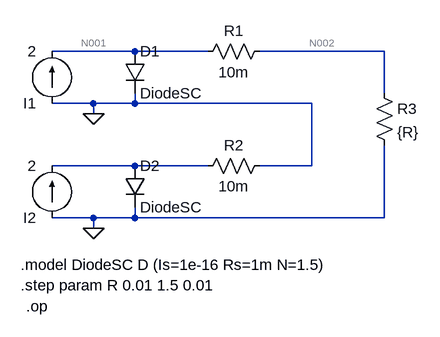
[diagram p0: schematic Draft4.asc]
Draft4.asc, the LTspice schematic file:
Version 4
SHEET 1 880 680
WIRE 128 128 0 128
WIRE 240 128 128 128
WIRE 512 128 320 128
WIRE 512 192 512 128
WIRE 64 208 0 208
WIRE 128 208 128 192
WIRE 128 208 64 208
WIRE 400 208 128 208
WIRE 64 224 64 208
WIRE 128 304 0 304
WIRE 240 304 128 304
WIRE 400 304 400 208
WIRE 400 304 320 304
WIRE 64 384 0 384
WIRE 128 384 128 368
WIRE 128 384 64 384
WIRE 512 384 512 272
WIRE 512 384 128 384
WIRE 64 400 64 384
FLAG 64 224 0
FLAG 64 400 0
SYMBOL diode 112 128 R0
SYMATTR InstName D1
SYMATTR Value DiodeSC
SYMBOL current 0 208 R180
WINDOW 123 0 0 Left 0
WINDOW 39 0 0 Left 0
SYMATTR InstName I1
SYMATTR Value 2
SYMBOL res 336 112 R90
WINDOW 0 0 56 VBottom 2
WINDOW 3 32 56 VTop 2
SYMATTR InstName R1
SYMATTR Value 10m
SYMBOL diode 112 304 R0
SYMATTR InstName D2
SYMATTR Value DiodeSC
SYMBOL current 0 384 R180
WINDOW 123 0 0 Left 0
WINDOW 39 0 0 Left 0
SYMATTR InstName I2
SYMATTR Value 2
SYMBOL res 336 288 R90
WINDOW 0 0 56 VBottom 2
WINDOW 3 32 56 VTop 2
SYMATTR InstName R2
SYMATTR Value 10m
SYMBOL res 496 176 R0
SYMATTR InstName R3
SYMATTR Value {R}
TEXT -48 456 Left 2 !.model DiodeSC D (Is=1e-16 Rs=1m N=1.5)
TEXT -48 488 Left 2 !.step param R 0.01 1.5 0.01
TEXT -40 520 Left 2 !.op

The netlist it stands for:
* Draft4.asc
D1 N001 0 DiodeSC
I1 0 N001 2
R1 N002 N001 10m
D2 N003 0 DiodeSC
I2 0 N003 2
R2 0 N003 10m
R3 N002 0 {R}
.model D D
.lib standard.dio
.model DiodeSC D (Is=1e-16 Rs=1m N=1.5)
.step param R 0.01 1.5 0.01
.op
.backanno
.end

* Results of the author's LTspice run, read from the files saved beside the schematic
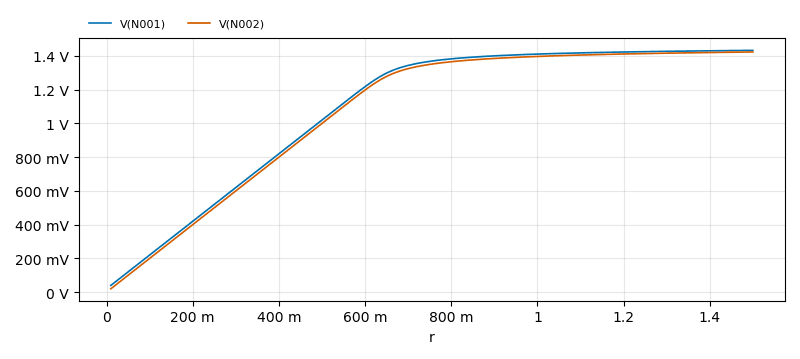
[diagram p1: Operating Point of Draft4.asc, plotted from the saved traces]
* Operating Point, 1 run:
*   V(N001): 40 mV at r=10 m, 1.432 V at r=1.5 , min 40 mV, max 1.432 V
*   V(N002): 20 mV at r=10 m, 1.423 V at r=1.5 , min 20 mV, max 1.423 V
* From the log:
*   Semiconductor Device Operating Points:
*                           --- Diodes ---
*   Name:      d2          d1
*   Model:   diodesc     diodesc
*   Id:      2.43e-14    4.16e-14
*   Vd:      2.00e-02    4.00e-02
*   Req:     9.96e+11    9.93e+11
*   CAP:     0.00e+00    0.00e+00